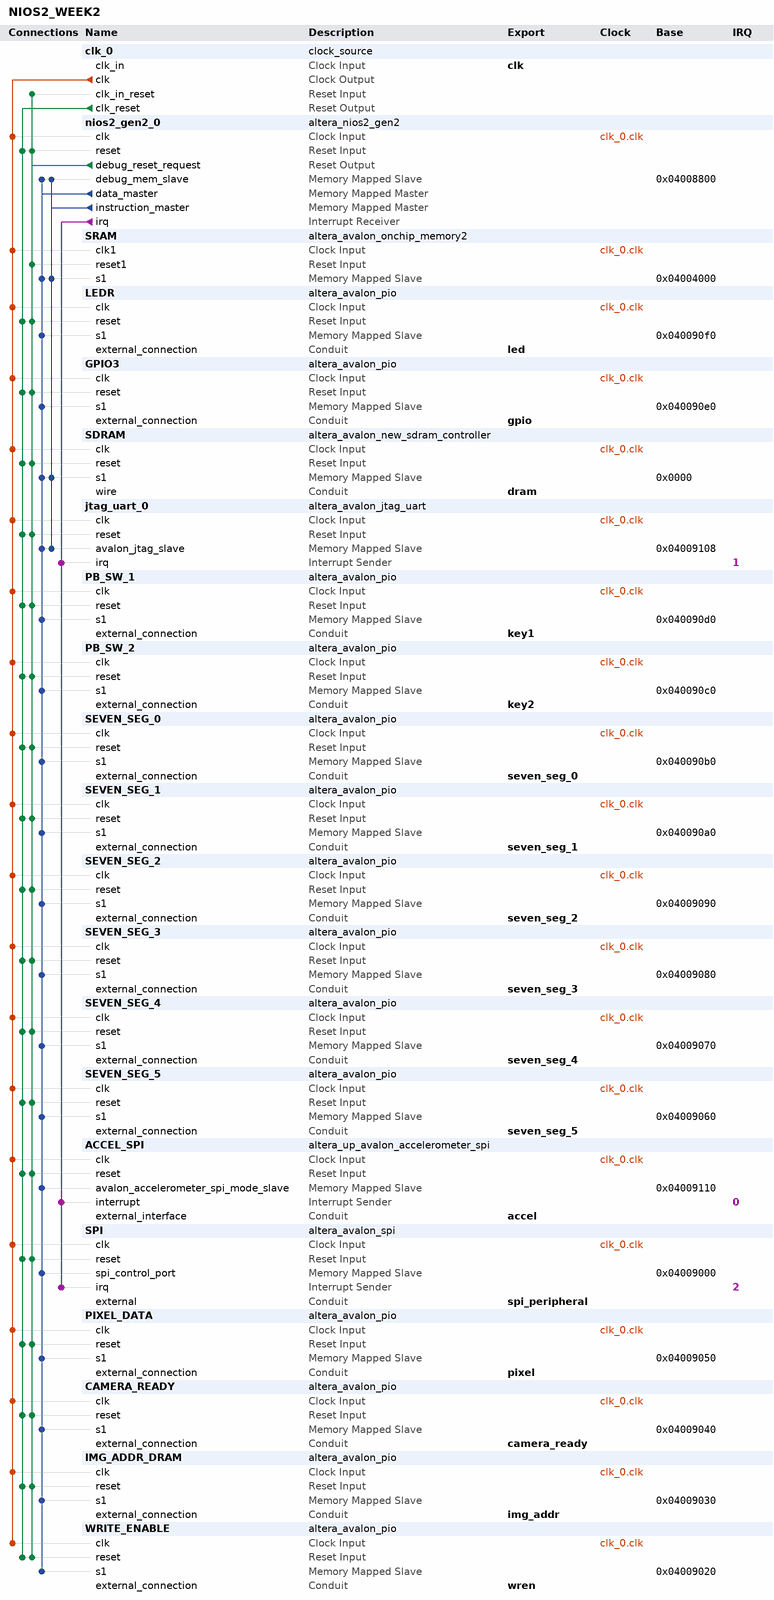
[diagram p0: system contents]
# Platform Designer (Qsys) system NIOS2_WEEK2, MAX 10 10M50DAF484C7G
# Parameters at their usual value, and those the tool derives, are not listed.
package require -exact qsys 18.1
create_system NIOS2_WEEK2
set_project_property DEVICE_FAMILY {MAX 10}
set_project_property DEVICE 10M50DAF484C7G

add_instance clk_0 clock_source 18.1
set_instance_parameter_value clk_0 clockFrequency 50000000

add_instance nios2_gen2_0 altera_nios2_gen2 18.1
set_instance_parameter_value nios2_gen2_0 dcache_size 2048
set_instance_parameter_value nios2_gen2_0 exceptionSlave SDRAM.s1
set_instance_parameter_value nios2_gen2_0 icache_size 4096
set_instance_parameter_value nios2_gen2_0 impl Tiny
set_instance_parameter_value nios2_gen2_0 resetSlave SDRAM.s1

add_instance SRAM altera_avalon_onchip_memory2 18.1
set_instance_parameter_value SRAM dataWidth 32
set_instance_parameter_value SRAM dualPort false
set_instance_parameter_value SRAM initMemContent false
set_instance_parameter_value SRAM initializationFileName onchip_mem.hex
set_instance_parameter_value SRAM memorySize 16384

add_instance LEDR altera_avalon_pio 18.1
set_instance_parameter_value LEDR direction Output
set_instance_parameter_value LEDR width 10

add_instance GPIO3 altera_avalon_pio 18.1
set_instance_parameter_value GPIO3 direction Output
set_instance_parameter_value GPIO3 width 1

add_instance SDRAM altera_avalon_new_sdram_controller 18.1
set_instance_parameter_value SDRAM TAC 5.5
set_instance_parameter_value SDRAM TRCD 20.0
set_instance_parameter_value SDRAM TRP 20.0
set_instance_parameter_value SDRAM casLatency 3
set_instance_parameter_value SDRAM columnWidth 10
set_instance_parameter_value SDRAM dataWidth 16
set_instance_parameter_value SDRAM generateSimulationModel false
set_instance_parameter_value SDRAM model single_Micron_MT48LC4M32B2_7_chip
set_instance_parameter_value SDRAM numberOfBanks 4
set_instance_parameter_value SDRAM numberOfChipSelects 1
set_instance_parameter_value SDRAM powerUpDelay 100.0
set_instance_parameter_value SDRAM refreshPeriod 15.625
set_instance_parameter_value SDRAM rowWidth 13

add_instance jtag_uart_0 altera_avalon_jtag_uart 18.1
set_instance_parameter_value jtag_uart_0 simInteractiveOptions NO_INTERACTIVE_WINDOWS

add_instance PB_SW_1 altera_avalon_pio 18.1
set_instance_parameter_value PB_SW_1 direction Input
set_instance_parameter_value PB_SW_1 width 1

add_instance PB_SW_2 altera_avalon_pio 18.1
set_instance_parameter_value PB_SW_2 direction Input
set_instance_parameter_value PB_SW_2 width 1

add_instance SEVEN_SEG_0 altera_avalon_pio 18.1
set_instance_parameter_value SEVEN_SEG_0 direction Output
set_instance_parameter_value SEVEN_SEG_0 width 8

add_instance SEVEN_SEG_1 altera_avalon_pio 18.1
set_instance_parameter_value SEVEN_SEG_1 direction Output
set_instance_parameter_value SEVEN_SEG_1 width 8

add_instance SEVEN_SEG_2 altera_avalon_pio 18.1
set_instance_parameter_value SEVEN_SEG_2 direction Output
set_instance_parameter_value SEVEN_SEG_2 width 8

add_instance SEVEN_SEG_3 altera_avalon_pio 18.1
set_instance_parameter_value SEVEN_SEG_3 direction Output
set_instance_parameter_value SEVEN_SEG_3 width 8

add_instance SEVEN_SEG_4 altera_avalon_pio 18.1
set_instance_parameter_value SEVEN_SEG_4 direction Output
set_instance_parameter_value SEVEN_SEG_4 width 8

add_instance SEVEN_SEG_5 altera_avalon_pio 18.1
set_instance_parameter_value SEVEN_SEG_5 direction Output
set_instance_parameter_value SEVEN_SEG_5 width 8

add_instance ACCEL_SPI altera_up_avalon_accelerometer_spi 18.0

add_instance SPI altera_avalon_spi 18.1
set_instance_parameter_value SPI clockPhase 1
set_instance_parameter_value SPI clockPolarity 1
set_instance_parameter_value SPI dataWidth 8
set_instance_parameter_value SPI masterSPI true
set_instance_parameter_value SPI numberOfSlaves 1
set_instance_parameter_value SPI targetClockRate 5000000

add_instance PIXEL_DATA altera_avalon_pio 18.1
set_instance_parameter_value PIXEL_DATA direction Output
set_instance_parameter_value PIXEL_DATA width 4

add_instance CAMERA_READY altera_avalon_pio 18.1
set_instance_parameter_value CAMERA_READY direction Input
set_instance_parameter_value CAMERA_READY width 1

add_instance IMG_ADDR_DRAM altera_avalon_pio 18.1
set_instance_parameter_value IMG_ADDR_DRAM direction Output
set_instance_parameter_value IMG_ADDR_DRAM width 17

add_instance WRITE_ENABLE altera_avalon_pio 18.1
set_instance_parameter_value WRITE_ENABLE direction Output
set_instance_parameter_value WRITE_ENABLE width 1

# connections
add_connection clk_0.clk ACCEL_SPI.clk clock
add_connection clk_0.clk CAMERA_READY.clk clock
add_connection clk_0.clk GPIO3.clk clock
add_connection clk_0.clk IMG_ADDR_DRAM.clk clock
add_connection clk_0.clk jtag_uart_0.clk clock
add_connection clk_0.clk LEDR.clk clock
add_connection clk_0.clk nios2_gen2_0.clk clock
add_connection clk_0.clk PB_SW_1.clk clock
add_connection clk_0.clk PB_SW_2.clk clock
add_connection clk_0.clk PIXEL_DATA.clk clock
add_connection clk_0.clk SDRAM.clk clock
add_connection clk_0.clk SEVEN_SEG_0.clk clock
add_connection clk_0.clk SEVEN_SEG_1.clk clock
add_connection clk_0.clk SEVEN_SEG_2.clk clock
add_connection clk_0.clk SEVEN_SEG_3.clk clock
add_connection clk_0.clk SEVEN_SEG_4.clk clock
add_connection clk_0.clk SEVEN_SEG_5.clk clock
add_connection clk_0.clk SPI.clk clock
add_connection clk_0.clk SRAM.clk1 clock
add_connection clk_0.clk WRITE_ENABLE.clk clock
add_connection clk_0.clk_reset ACCEL_SPI.reset reset
add_connection clk_0.clk_reset CAMERA_READY.reset reset
add_connection clk_0.clk_reset GPIO3.reset reset
add_connection clk_0.clk_reset IMG_ADDR_DRAM.reset reset
add_connection clk_0.clk_reset jtag_uart_0.reset reset
add_connection clk_0.clk_reset LEDR.reset reset
add_connection clk_0.clk_reset nios2_gen2_0.reset reset
add_connection clk_0.clk_reset PB_SW_1.reset reset
add_connection clk_0.clk_reset PB_SW_2.reset reset
add_connection clk_0.clk_reset PIXEL_DATA.reset reset
add_connection clk_0.clk_reset SDRAM.reset reset
add_connection clk_0.clk_reset SEVEN_SEG_0.reset reset
add_connection clk_0.clk_reset SEVEN_SEG_1.reset reset
add_connection clk_0.clk_reset SEVEN_SEG_2.reset reset
add_connection clk_0.clk_reset SEVEN_SEG_3.reset reset
add_connection clk_0.clk_reset SEVEN_SEG_4.reset reset
add_connection clk_0.clk_reset SEVEN_SEG_5.reset reset
add_connection clk_0.clk_reset SPI.reset reset
add_connection clk_0.clk_reset WRITE_ENABLE.reset reset
add_connection nios2_gen2_0.debug_reset_request ACCEL_SPI.reset reset
add_connection nios2_gen2_0.debug_reset_request CAMERA_READY.reset reset
add_connection nios2_gen2_0.debug_reset_request clk_0.clk_in_reset reset
add_connection nios2_gen2_0.debug_reset_request GPIO3.reset reset
add_connection nios2_gen2_0.debug_reset_request IMG_ADDR_DRAM.reset reset
add_connection nios2_gen2_0.debug_reset_request jtag_uart_0.reset reset
add_connection nios2_gen2_0.debug_reset_request LEDR.reset reset
add_connection nios2_gen2_0.debug_reset_request nios2_gen2_0.reset reset
add_connection nios2_gen2_0.debug_reset_request PB_SW_1.reset reset
add_connection nios2_gen2_0.debug_reset_request PB_SW_2.reset reset
add_connection nios2_gen2_0.debug_reset_request PIXEL_DATA.reset reset
add_connection nios2_gen2_0.debug_reset_request SDRAM.reset reset
add_connection nios2_gen2_0.debug_reset_request SEVEN_SEG_0.reset reset
add_connection nios2_gen2_0.debug_reset_request SEVEN_SEG_1.reset reset
add_connection nios2_gen2_0.debug_reset_request SEVEN_SEG_2.reset reset
add_connection nios2_gen2_0.debug_reset_request SEVEN_SEG_3.reset reset
add_connection nios2_gen2_0.debug_reset_request SEVEN_SEG_4.reset reset
add_connection nios2_gen2_0.debug_reset_request SEVEN_SEG_5.reset reset
add_connection nios2_gen2_0.debug_reset_request SPI.reset reset
add_connection nios2_gen2_0.debug_reset_request SRAM.reset1 reset
add_connection nios2_gen2_0.debug_reset_request WRITE_ENABLE.reset reset
add_connection nios2_gen2_0.data_master ACCEL_SPI.avalon_accelerometer_spi_mode_slave avalon
set_connection_parameter_value nios2_gen2_0.data_master/ACCEL_SPI.avalon_accelerometer_spi_mode_slave baseAddress 0x04009110
add_connection nios2_gen2_0.data_master CAMERA_READY.s1 avalon
set_connection_parameter_value nios2_gen2_0.data_master/CAMERA_READY.s1 baseAddress 0x04009040
add_connection nios2_gen2_0.data_master GPIO3.s1 avalon
set_connection_parameter_value nios2_gen2_0.data_master/GPIO3.s1 baseAddress 0x040090e0
add_connection nios2_gen2_0.data_master IMG_ADDR_DRAM.s1 avalon
set_connection_parameter_value nios2_gen2_0.data_master/IMG_ADDR_DRAM.s1 baseAddress 0x04009030
add_connection nios2_gen2_0.data_master jtag_uart_0.avalon_jtag_slave avalon
set_connection_parameter_value nios2_gen2_0.data_master/jtag_uart_0.avalon_jtag_slave baseAddress 0x04009108
add_connection nios2_gen2_0.data_master LEDR.s1 avalon
set_connection_parameter_value nios2_gen2_0.data_master/LEDR.s1 baseAddress 0x040090f0
add_connection nios2_gen2_0.data_master nios2_gen2_0.debug_mem_slave avalon
set_connection_parameter_value nios2_gen2_0.data_master/nios2_gen2_0.debug_mem_slave baseAddress 0x04008800
add_connection nios2_gen2_0.data_master PB_SW_1.s1 avalon
set_connection_parameter_value nios2_gen2_0.data_master/PB_SW_1.s1 baseAddress 0x040090d0
add_connection nios2_gen2_0.data_master PB_SW_2.s1 avalon
set_connection_parameter_value nios2_gen2_0.data_master/PB_SW_2.s1 baseAddress 0x040090c0
add_connection nios2_gen2_0.data_master PIXEL_DATA.s1 avalon
set_connection_parameter_value nios2_gen2_0.data_master/PIXEL_DATA.s1 baseAddress 0x04009050
add_connection nios2_gen2_0.data_master SDRAM.s1 avalon
set_connection_parameter_value nios2_gen2_0.data_master/SDRAM.s1 baseAddress 0x0000
add_connection nios2_gen2_0.data_master SEVEN_SEG_0.s1 avalon
set_connection_parameter_value nios2_gen2_0.data_master/SEVEN_SEG_0.s1 baseAddress 0x040090b0
add_connection nios2_gen2_0.data_master SEVEN_SEG_1.s1 avalon
set_connection_parameter_value nios2_gen2_0.data_master/SEVEN_SEG_1.s1 baseAddress 0x040090a0
add_connection nios2_gen2_0.data_master SEVEN_SEG_2.s1 avalon
set_connection_parameter_value nios2_gen2_0.data_master/SEVEN_SEG_2.s1 baseAddress 0x04009090
add_connection nios2_gen2_0.data_master SEVEN_SEG_3.s1 avalon
set_connection_parameter_value nios2_gen2_0.data_master/SEVEN_SEG_3.s1 baseAddress 0x04009080
add_connection nios2_gen2_0.data_master SEVEN_SEG_4.s1 avalon
set_connection_parameter_value nios2_gen2_0.data_master/SEVEN_SEG_4.s1 baseAddress 0x04009070
add_connection nios2_gen2_0.data_master SEVEN_SEG_5.s1 avalon
set_connection_parameter_value nios2_gen2_0.data_master/SEVEN_SEG_5.s1 baseAddress 0x04009060
add_connection nios2_gen2_0.data_master SPI.spi_control_port avalon
set_connection_parameter_value nios2_gen2_0.data_master/SPI.spi_control_port baseAddress 0x04009000
add_connection nios2_gen2_0.data_master SRAM.s1 avalon
set_connection_parameter_value nios2_gen2_0.data_master/SRAM.s1 baseAddress 0x04004000
add_connection nios2_gen2_0.data_master WRITE_ENABLE.s1 avalon
set_connection_parameter_value nios2_gen2_0.data_master/WRITE_ENABLE.s1 baseAddress 0x04009020
add_connection nios2_gen2_0.instruction_master jtag_uart_0.avalon_jtag_slave avalon
set_connection_parameter_value nios2_gen2_0.instruction_master/jtag_uart_0.avalon_jtag_slave baseAddress 0x04009108
add_connection nios2_gen2_0.instruction_master nios2_gen2_0.debug_mem_slave avalon
set_connection_parameter_value nios2_gen2_0.instruction_master/nios2_gen2_0.debug_mem_slave baseAddress 0x04008800
add_connection nios2_gen2_0.instruction_master SDRAM.s1 avalon
set_connection_parameter_value nios2_gen2_0.instruction_master/SDRAM.s1 baseAddress 0x0000
add_connection nios2_gen2_0.instruction_master SRAM.s1 avalon
set_connection_parameter_value nios2_gen2_0.instruction_master/SRAM.s1 baseAddress 0x04004000
add_connection nios2_gen2_0.irq ACCEL_SPI.interrupt interrupt
set_connection_parameter_value nios2_gen2_0.irq/ACCEL_SPI.interrupt irqNumber 0
add_connection nios2_gen2_0.irq jtag_uart_0.irq interrupt
set_connection_parameter_value nios2_gen2_0.irq/jtag_uart_0.irq irqNumber 1
add_connection nios2_gen2_0.irq SPI.irq interrupt
set_connection_parameter_value nios2_gen2_0.irq/SPI.irq irqNumber 2

# exported interfaces
add_interface accel conduit end
set_interface_property accel EXPORT_OF ACCEL_SPI.external_interface
add_interface camera_ready conduit end
set_interface_property camera_ready EXPORT_OF CAMERA_READY.external_connection
add_interface clk clock sink
set_interface_property clk EXPORT_OF clk_0.clk_in
add_interface dram conduit end
set_interface_property dram EXPORT_OF SDRAM.wire
add_interface gpio conduit end
set_interface_property gpio EXPORT_OF GPIO3.external_connection
add_interface img_addr conduit end
set_interface_property img_addr EXPORT_OF IMG_ADDR_DRAM.external_connection
add_interface key1 conduit end
set_interface_property key1 EXPORT_OF PB_SW_1.external_connection
add_interface key2 conduit end
set_interface_property key2 EXPORT_OF PB_SW_2.external_connection
add_interface led conduit end
set_interface_property led EXPORT_OF LEDR.external_connection
add_interface pixel conduit end
set_interface_property pixel EXPORT_OF PIXEL_DATA.external_connection
add_interface seven_seg_0 conduit end
set_interface_property seven_seg_0 EXPORT_OF SEVEN_SEG_0.external_connection
add_interface seven_seg_1 conduit end
set_interface_property seven_seg_1 EXPORT_OF SEVEN_SEG_1.external_connection
add_interface seven_seg_2 conduit end
set_interface_property seven_seg_2 EXPORT_OF SEVEN_SEG_2.external_connection
add_interface seven_seg_3 conduit end
set_interface_property seven_seg_3 EXPORT_OF SEVEN_SEG_3.external_connection
add_interface seven_seg_4 conduit end
set_interface_property seven_seg_4 EXPORT_OF SEVEN_SEG_4.external_connection
add_interface seven_seg_5 conduit end
set_interface_property seven_seg_5 EXPORT_OF SEVEN_SEG_5.external_connection
add_interface spi_peripheral conduit end
set_interface_property spi_peripheral EXPORT_OF SPI.external
add_interface wren conduit end
set_interface_property wren EXPORT_OF WRITE_ENABLE.external_connection

set_interconnect_requirement {$system} qsys_mm.clockCrossingAdapter HANDSHAKE
set_interconnect_requirement {$system} qsys_mm.enableEccProtection FALSE
set_interconnect_requirement {$system} qsys_mm.insertDefaultSlave FALSE
set_interconnect_requirement {$system} qsys_mm.maxAdditionalLatency 1

save_system NIOS2_WEEK2.qsys
